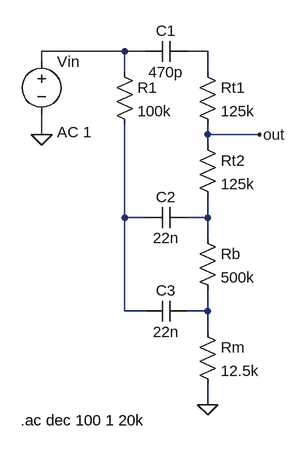
[diagram p0: schematic FMV Tone Stack.asc]
FMV Tone Stack.asc, the LTspice schematic file:
Version 4
SHEET 1 880 836
WIRE 128 48 0 48
WIRE 160 48 128 48
WIRE 256 48 224 48
WIRE 0 64 0 48
WIRE 128 80 128 48
WIRE 256 80 256 48
WIRE 0 176 0 144
WIRE 256 176 256 160
WIRE 336 176 256 176
WIRE 256 192 256 176
WIRE 128 304 128 160
WIRE 160 304 128 304
WIRE 256 304 256 272
WIRE 256 304 224 304
WIRE 256 336 256 304
WIRE 128 448 128 304
WIRE 160 448 128 448
WIRE 256 448 256 416
WIRE 256 448 224 448
WIRE 256 480 256 448
WIRE 256 592 256 560
FLAG 256 592 0
FLAG 0 176 0
FLAG 336 176 out
SYMBOL res 112 64 R0
SYMATTR InstName R1
SYMATTR Value 100k
SYMBOL cap 224 32 R90
WINDOW 0 0 32 VBottom 2
WINDOW 3 32 32 VTop 2
SYMATTR InstName C1
SYMATTR Value 470p
SYMBOL res 240 64 R0
SYMATTR InstName Rt1
SYMATTR Value 125k
SYMBOL res 240 176 R0
SYMATTR InstName Rt2
SYMATTR Value 125k
SYMBOL cap 224 288 R90
WINDOW 0 0 32 VBottom 2
WINDOW 3 32 32 VTop 2
SYMATTR InstName C2
SYMATTR Value 22n
SYMBOL res 240 320 R0
SYMATTR InstName Rb
SYMATTR Value 500k
SYMBOL res 240 464 R0
SYMATTR InstName Rm
SYMATTR Value 12.5k
SYMBOL cap 224 432 R90
WINDOW 0 0 32 VBottom 2
WINDOW 3 32 32 VTop 2
SYMATTR InstName C3
SYMATTR Value 22n
SYMBOL voltage 0 48 R0
WINDOW 123 24 124 Left 2
WINDOW 39 0 0 Left 0
SYMATTR Value2 AC 1
SYMATTR InstName Vin
SYMATTR Value ""
TEXT -32 616 Left 2 !.ac dec 100 1 20k

The netlist it stands for:
* FMV Tone Stack.asc
R1 N001 N003 100k
C1 N002 N001 470p
Rt1 N002 out 125k
Rt2 out N004 125k
C2 N004 N003 22n
Rb N004 N005 500k
Rm N005 0 12.5k
C3 N005 N003 22n
Vin N001 0 AC 1
.ac dec 100 1 20k
.backanno
.end